# EAGLE schematic 4 channel breakout (EAGLE 7.2.0)
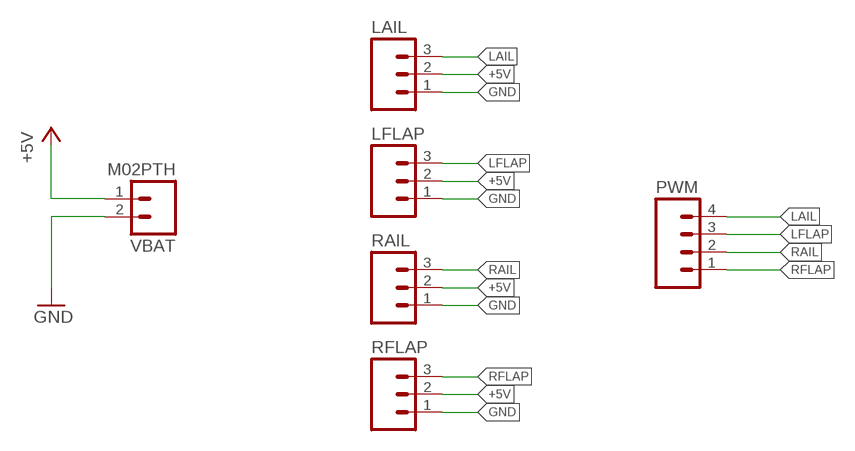
[diagram p0: schematic, sheet 1]

## Parts
LAIL  M03LOCK  [1X03_LOCK]
LFLAP  M03LOCK  [1X03_LOCK]
PWM  M04PTH  [1X04]
RAIL  M03LOCK  [1X03_LOCK]
RFLAP  M03LOCK  [1X03_LOCK]
VBAT  M02PTH  [1X02]

## Nets
+5V: LAIL.2 LFLAP.2 RAIL.2 RFLAP.2 VBAT.1
GND: LAIL.1 LFLAP.1 RAIL.1 RFLAP.1 VBAT.2
LAIL: LAIL.3 PWM.4
LFLAP: LFLAP.3 PWM.3
RAIL: PWM.2 RAIL.3
RFLAP: PWM.1 RFLAP.3

## Library data of the parts
LAIL LFLAP RAIL RFLAP = SparkFun-Connectors:M03: Header 3 Standard 3-pin 0.1" header. Use with straight break away headers (SKU : PRT-00116), right angle break away headers (PRT-00553), swiss pins (PRT-00743), machine pins (PRT-00117), and female headers (PRT-00115). Molex polarized connector foot print use with SKU : PRT-08232 with associated crimp pins and housings.
PWM = SparkFun-Connectors:M04: Header 4 Standard 4-pin 0.1" header. Use with straight break away headers (SKU : PRT-00116), right angle break away headers (PRT-00553), swiss pins (PRT-00743), machine pins (PRT-00117), and female headers (PRT-00115). Molex polarized connector foot print use with SKU : PRT-08231 with associated crimp pins and housings. 1MM SMD Version SKU: PRT-10208
VBAT = SparkFun-Connectors:M02: Standard 2-pin 0.1" header. Use with - straight break away headers ( PRT-00116) - right angle break away headers (PRT-00553) - swiss pins (PRT-00743) - machine pins (PRT-00117) - female headers (PRT-00115) Molex polarized connector foot print use with: PRT-08233 with associated crimp pins and housings. 2.54_SCREWTERM for use with PRT-10571. 3.5mm Screw Terminal footprints for PRT-08084 5mm Screw Terminal footprints for use with PRT-08432